# Altium schematic sheet MOTOR_DRV.SchDoc
size A4; SheetNumber: 4; SheetTotal: 4
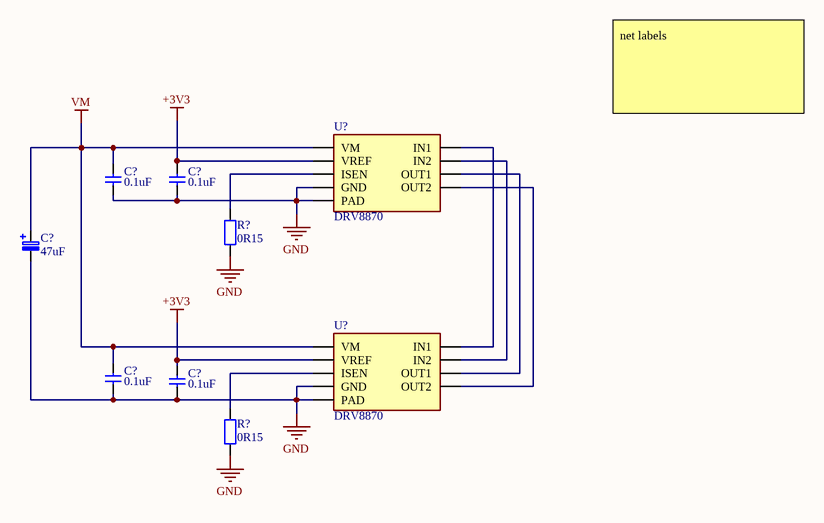
[diagram p0: MOTOR_DRV.SchDoc]

## Parts
(Parts that share a designator on the sheet are numbered #1, #2 ... from top to bottom, then left to right.)
C?#1  0.1uF  [CAP0805]
C?#2  0.1uF  [CAP0603]
C?#3  47uF  [CAP_TANT_C]
C?#4  0.1uF  [CAP0805]
C?#5  0.1uF  [CAP0603]
R?#1  0R15  [RES2512]
R?#2  0R15  [RES2512]
U?#1  DRV8870  [SOIC-8 thermal]
U?#2  DRV8870  [SOIC-8 thermal]

## Nets
+3V3: C?#2.2 C?#5.2 U?#1.4(VREF) U?#2.4(VREF)
GND: C?#1.1 C?#2.1 C?#3.1 C?#4.1 C?#5.1 R?#1.1 R?#2.1 U?#1.1(GND) U?#1.9(PAD) U?#2.1(GND) U?#2.9(PAD)
VM: C?#1.2 C?#3.2 C?#4.2 U?#1.5(VM) U?#2.5(VM)
NetR?#1_2: R?#1.2 U?#1.7(ISEN)
NetR?#2_2: R?#2.2 U?#2.7(ISEN)
NetU?#1_2: U?#1.2(IN2) U?#2.2(IN2)
NetU?#1_3: U?#1.3(IN1) U?#2.3(IN1)
NetU?#1_6: U?#1.6(OUT1) U?#2.6(OUT1)
NetU?#1_8: U?#1.8(OUT2) U?#2.8(OUT2)

## Notes on the sheet
- net labels

## Library data of the parts
C?#1 C?#2 C?#4 C?#5 = CAP Ceramic: Ceramic SMD Cap
C?#3 = CAP Tantal: Tantal SMD Cap
R?#1 R?#2 = RES: RES smd
U?#1 U?#2 = DRV8870: DC motor driver 3.6A